# Altium schematic sheet 003_Serial_Port.SchDoc: =title_line_1 + title_line_2
size 594 x 420 mm; SheetNumber: 3
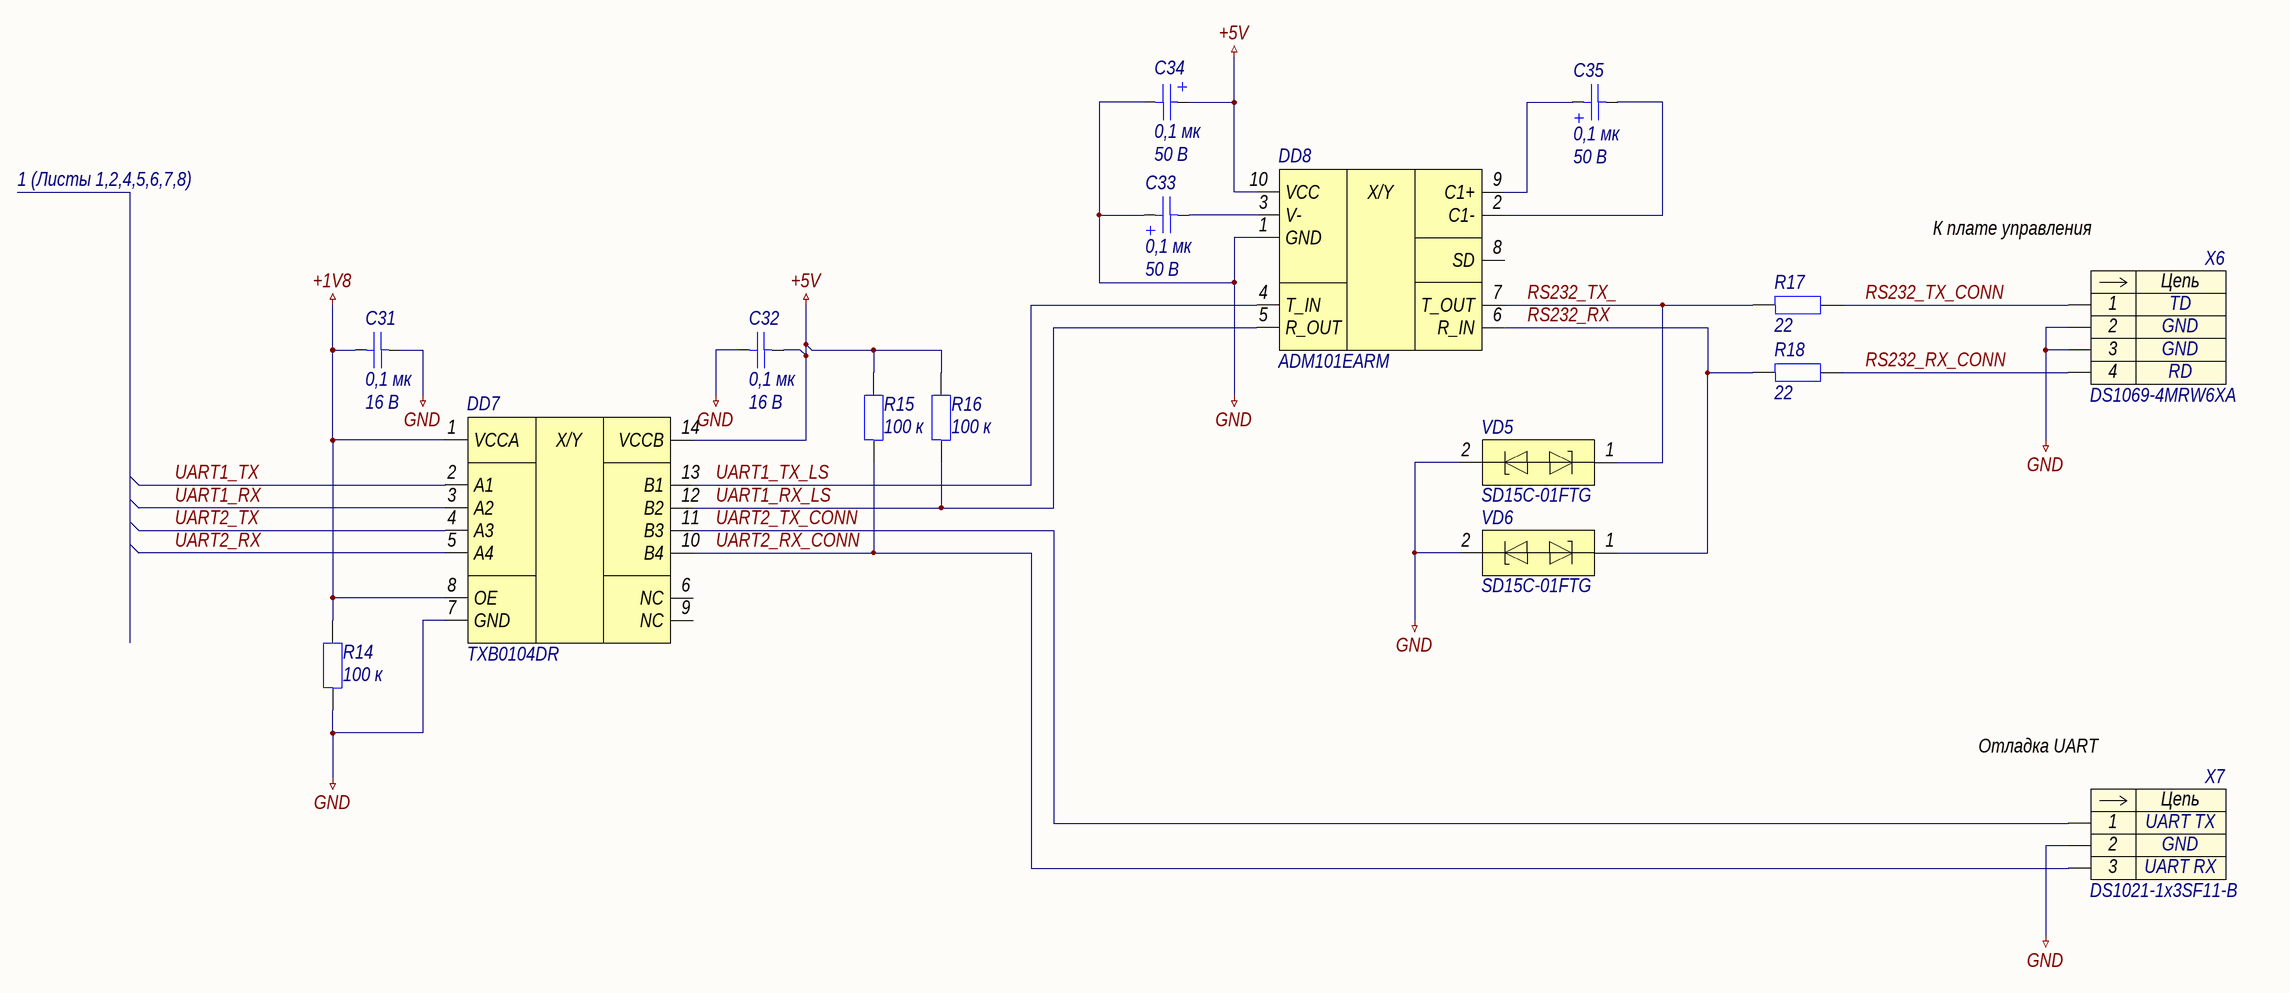
[diagram p0: 003_Serial_Port.SchDoc]

## Parts
C31  0,1 мк  Напряжение: 16 В  [C0603]
C32  0,1 мк  Напряжение: 16 В  [C0603]
C33  0,1 мк  Напряжение: 50 В  [C3216-18]
C34  0,1 мк  Напряжение: 50 В  [C3216-18]
C35  0,1 мк  Напряжение: 50 В  [C3216-18]
DD7  TXB0104DR  [SOIC-14-P127-865X390X175-L84X41]
DD8  ADM101EARM  [MSOP-10-P50-300X300X110-L55X23]
R14  100 к  [R0603]
R15  100 к  [R0603]
R16  100 к  [R0603]
R17  22  [R0603]
R18  22  [R0603]
VD5  SD15C-01FTG  [SOD-323-257X130X114]
VD6  SD15C-01FTG  [SOD-323-257X130X114]
X6  DS1069-4MRW6XA  [DS1069-4MRW6XA]
X7  DS1021-1x3SF11-B  [DS1021-1X3SF11-B]

## Nets
+1V8: C31.1 DD7.1(VCCA) DD7.8(OE) R14.2
+5V: C32.2 C34.1 DD7.14(VCCB) DD8.10(VCC) R15.2 R16.2
GND: C31.2 C32.1 C33.1 C34.2 DD7.7(GND) DD8.1(GND) R14.1 VD5.2 VD6.2 X6.2 X6.3 X7.2
RS232_RX: DD8.6(R_IN) R18.1 VD6.1
RS232_RX_CONN: R18.2 X6.4
RS232_TX_: DD8.7(T_OUT) R17.1 VD5.1
RS232_TX_CONN: R17.2 X6.1
UART1_RX: DD7.3(A2)
UART1_RX_LS: DD7.12(B2) DD8.5(R_OUT) R16.1
UART1_TX: DD7.2(A1)
UART1_TX_LS: DD7.13(B1) DD8.4(T_IN)
UART2_RX: DD7.5(A4)
UART2_RX_CONN: DD7.10(B4) R15.1 X7.3
UART2_TX: DD7.4(A3)
UART2_TX_CONN: DD7.11(B3) X7.1
NetC33_2: C33.2 DD8.3(V-)
NetC35_1: C35.1 DD8.9(C1+)
NetC35_2: C35.2 DD8.2(C1-)

Not connected (* = marked no-connect by the designer): DD7 6(NC) 9(NC); DD8 8(SD)

## Notes on the sheet
- 1 (Листы 1,2,4,5,6,7,8)
- К плате управления STM32F413
- Отладка UART Debug
- Подп. и дата
- Инв. № дубл.
- Взам. инв. №
- Инв. № подл.
- Лист
- Изм.
- № докум.
- Подп.
- Дата
- Копировал
- Формат
- А2
- (in symbol dd0002) X/Y
- (in symbol dd0012) X/Y
- (in symbol x0026) Цепь
- (in symbol x0044) Цепь

## Library data of the parts
C31 C32 = c0081: =Описание; ID: c0081; Фамилия: Паньков; Описание: Конденсатор керамический чип 0603 100 нФ 16 В ±10 %; Наименование: CC0603KRX7R7BB104; Производитель: YAGEO Corp.; Отклонение: ±10 %; Рабочие температуры: от –55 °С до +125 °С; Температурный коэффициент емкости: X7R; Корпус: 0603; Номинал: 0,1 мк; Номинальное напряжение: 16 В; HelpURL: https://www.yageo.com/upload/media/product/productsearch/datasheet/mlcc/UPY-GPHC_X7R_6.3V-to-50V_20.pdf
C33-C35 = c0001: =Описание; ID: c0001; Фамилия: Ларионов; Описание: Конденсатор танталовый чип 3216-18 100 нФ 50 В ±10 %; Наименование: 293D104X9050A2TE3; Производитель: Vishay Intertechnology, Inc.; Отклонение: ±10 %; Эквивалентное последовательное сопротивление: 19,0 Ом; Среднеквадратичный размах пульсации тока: 0,06 А; Рабочие температуры: от –55 °С до +125 °С; Корпус: 3216-18; Номинал: 0,1 мк; Номинальное напряжение: 50 В; HelpURL: https://www.vishay.com/capacitors/list/product-40002/
DD7 = dd0002: =Описание; ID: dd0002; Фамилия: Ларионов; Описание: Преобразователь логического уровня 3,6 В и 5,5 В 4 линии; Производитель: Texas Instruments Inc.; Входное напряжение: от 1,2 В до 3,6 В; Выходное напряжение: от 1,65 В до 5,5 В; Рабочие температуры: от –40 °С до +85 °С; Корпус: SOIC-14; Наименование: TXB0104DR; HelpURL: https://www.ti.com/product/TXB0104
DD8 = dd0012: =Описание; ID: dd0012; Фамилия: Демчева; Описание: Приемопередатчик RS-232; Производитель: Analog Devices, Inc.; Рабочие температуры: от –40 до +85 °C; Корпус: MSOP-10; Наименование: ADM101EARM; HelpURL: https://www.analog.com/ru/products/adm101e.html
R14-R16 = r0141: =Описание; ID: r0141; Фамилия: Водорезов; Описание: Резистор чип 0603 100 кОм ±1 % 0,1 Вт; Наименование: RC0603FR-07100KL; Производитель: YAGEO Corp.; Отклонение: ±1 %; Номинальное напряжение: 75 В; Номинальный ток: 1 А; Рабочие температуры: от –55 °С до +155 °С; Корпус: 0603; Примечание: Ряд E24; Номинал: 100 к; HelpURL: https://www.yageo.com/upload/media/product/productsearch/datasheet/rchip/PYu-RC_Group_51_RoHS_L_11.pdf
R17 R18 = r0034: =Описание; ID: r0034; Фамилия: Ларионов; Описание: Резистор чип 0603 22 Ом ±1 % 0,1 Вт; Наименование: RC0603FR-0722RL; Производитель: YAGEO Corp.; Отклонение: ±1 %; Номинальное напряжение: 75 В; Номинальный ток: 1 А; Рабочие температуры: от –55 °С до +155 °С; Корпус: 0603; Примечание: Ряд E24; Номинал: 22; HelpURL: https://www.yageo.com/upload/media/product/productsearch/datasheet/rchip/PYu-RC_Group_51_RoHS_L_11.pdf
VD5 VD6 = vd0006: =Описание; ID: vd0006; Фамилия: Ларионов; Описание: Двунаправленная диодная сборка для подавления помех 15 В; Производитель: Littelfuse, Inc.; Корпус: SOD-323; Наименование: SD15C-01FTG; HelpURL: https://www.littelfuse.com/products/tvs-diode-arrays/general-purpose-esd-protection/sdc/sd15c_01ftg.aspx
X6 = x0044: =Описание; Contact_1: TD; Contact_2: GND; Contact_4: RD; ID: x0044; Фамилия: Паньков; Описание: CWF 4 pin Type A 2,5 мм вилка угловой; Производитель: Connfly Electronic Co., Ltd.; Contact_3: GND; Наименование: DS1069-4MRW6XA; HelpURL: http://en.connfly.group/product/xVkr=EusQssAN0gN=Aos=mU+UrVkR9kqEAN0gN0MUR+g+NB+A
X7 = x0026: =Описание; Contact_1: UART TX; Contact_2: GND; Contact_3: UART RX; ID: x0026; Фамилия: Паньков; Описание: PLS 3 pin 2,54 мм вилка прямой; Производитель: Connfly Electronic Co., Ltd.; Наименование: DS1021-1x3SF11-B; HelpURL: http://en.connfly.group/product/xVkr=EusQssAN0gN=Aos=mU+UrVkR9kqEAN0gN9g+WqANB+A